# Altium schematic sheet Cal_Laser_Board.SchDoc
size B
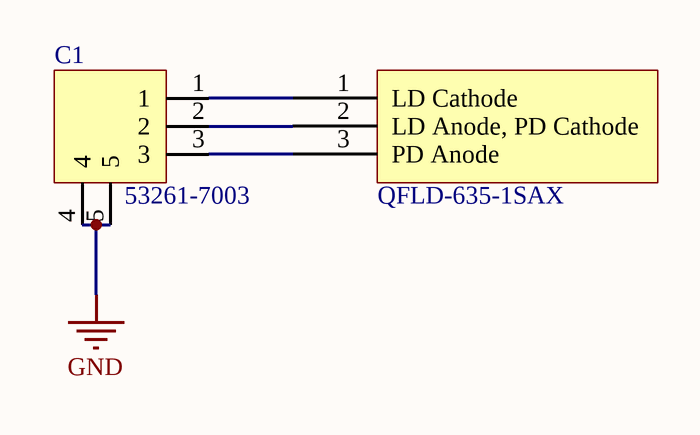
[diagram p0: Cal_Laser_Board.SchDoc]

## Parts
C1  53261-7003  [532617003]
L1  QFLD-635-1SAX  [QFLD-635-1SAX]

## Nets
GND: C1.4 C1.5
NetC1_1: C1.1 L1.1(LD_Cathode)
NetC1_2: C1.2 L1.2(LD_Anode,_PD_Cathode)
NetC1_3: C1.3 L1.3(PD_Anode)